# Altium schematic sheet Motorcycle_ECU.SchDoc: Motorcycle_ECU
size A2; DrawnBy: mzy2364; Revision: V3.5
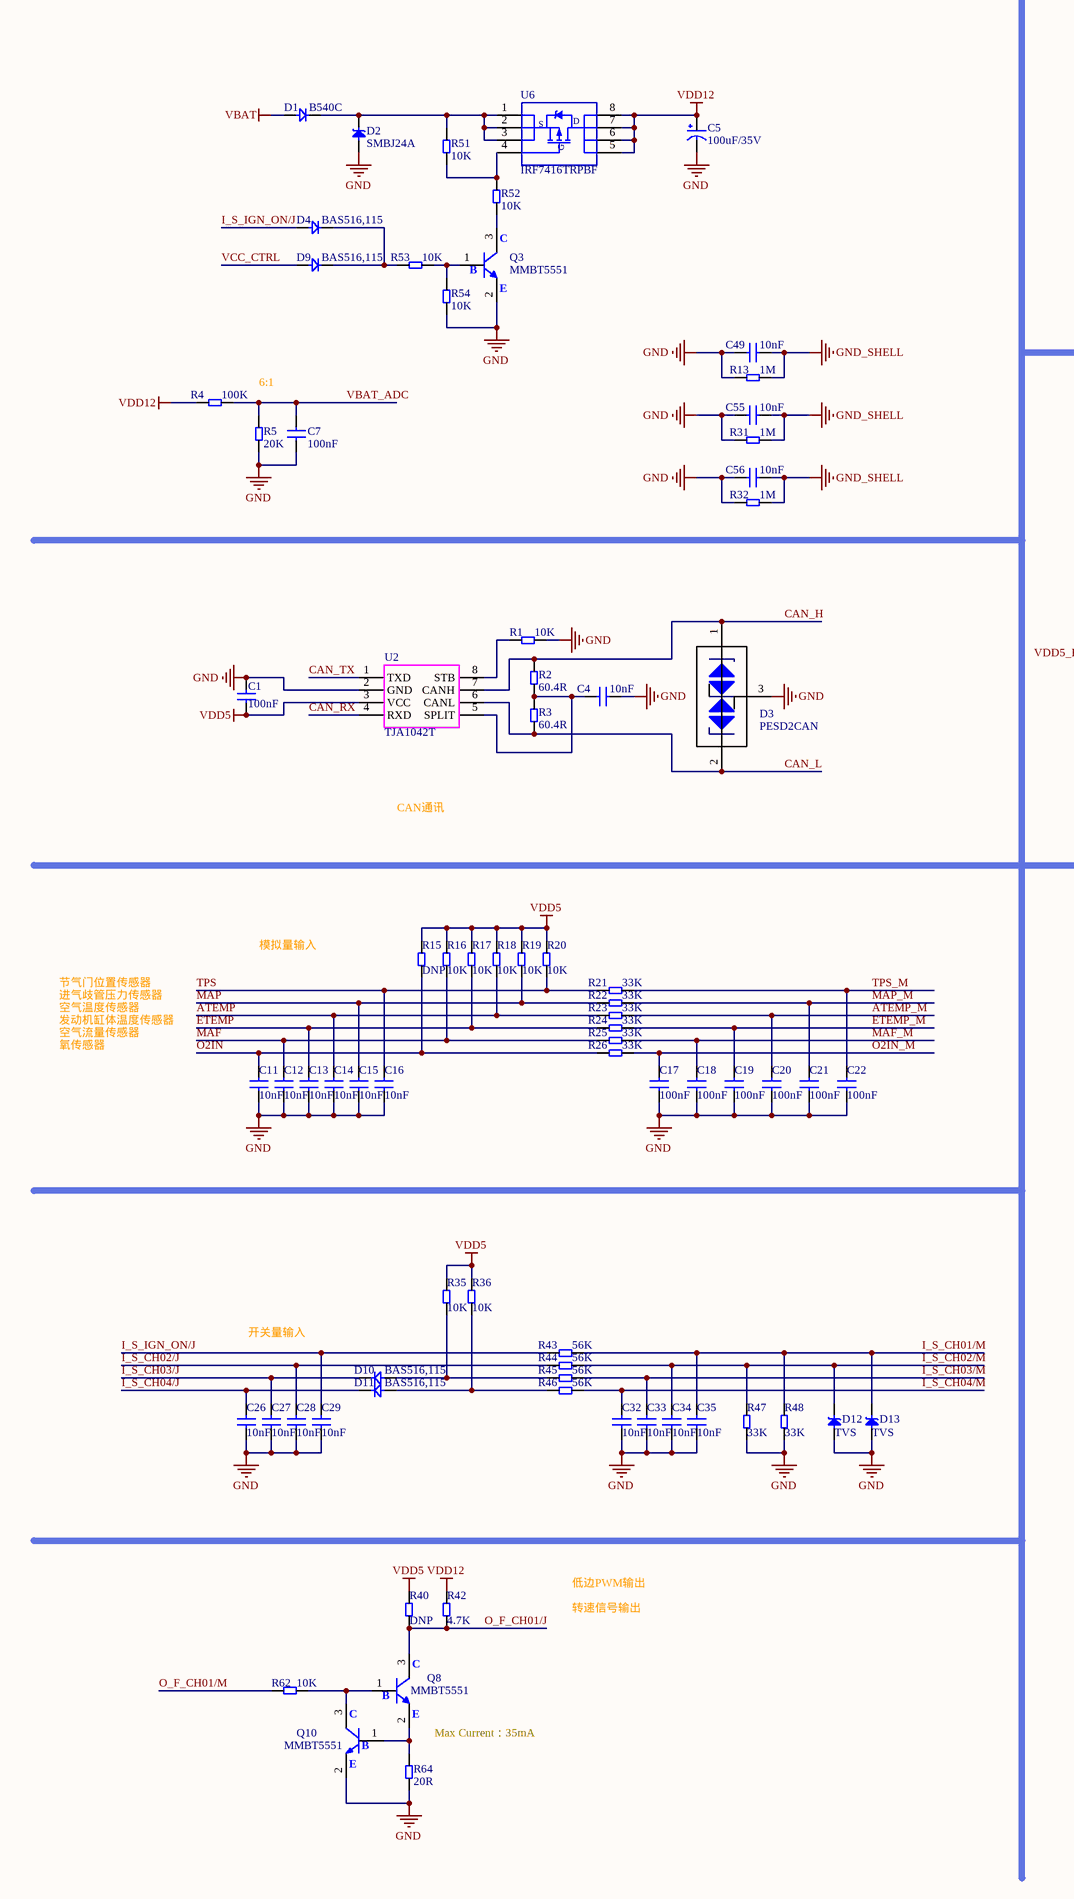
[diagram p0: Motorcycle_ECU.SchDoc, left]
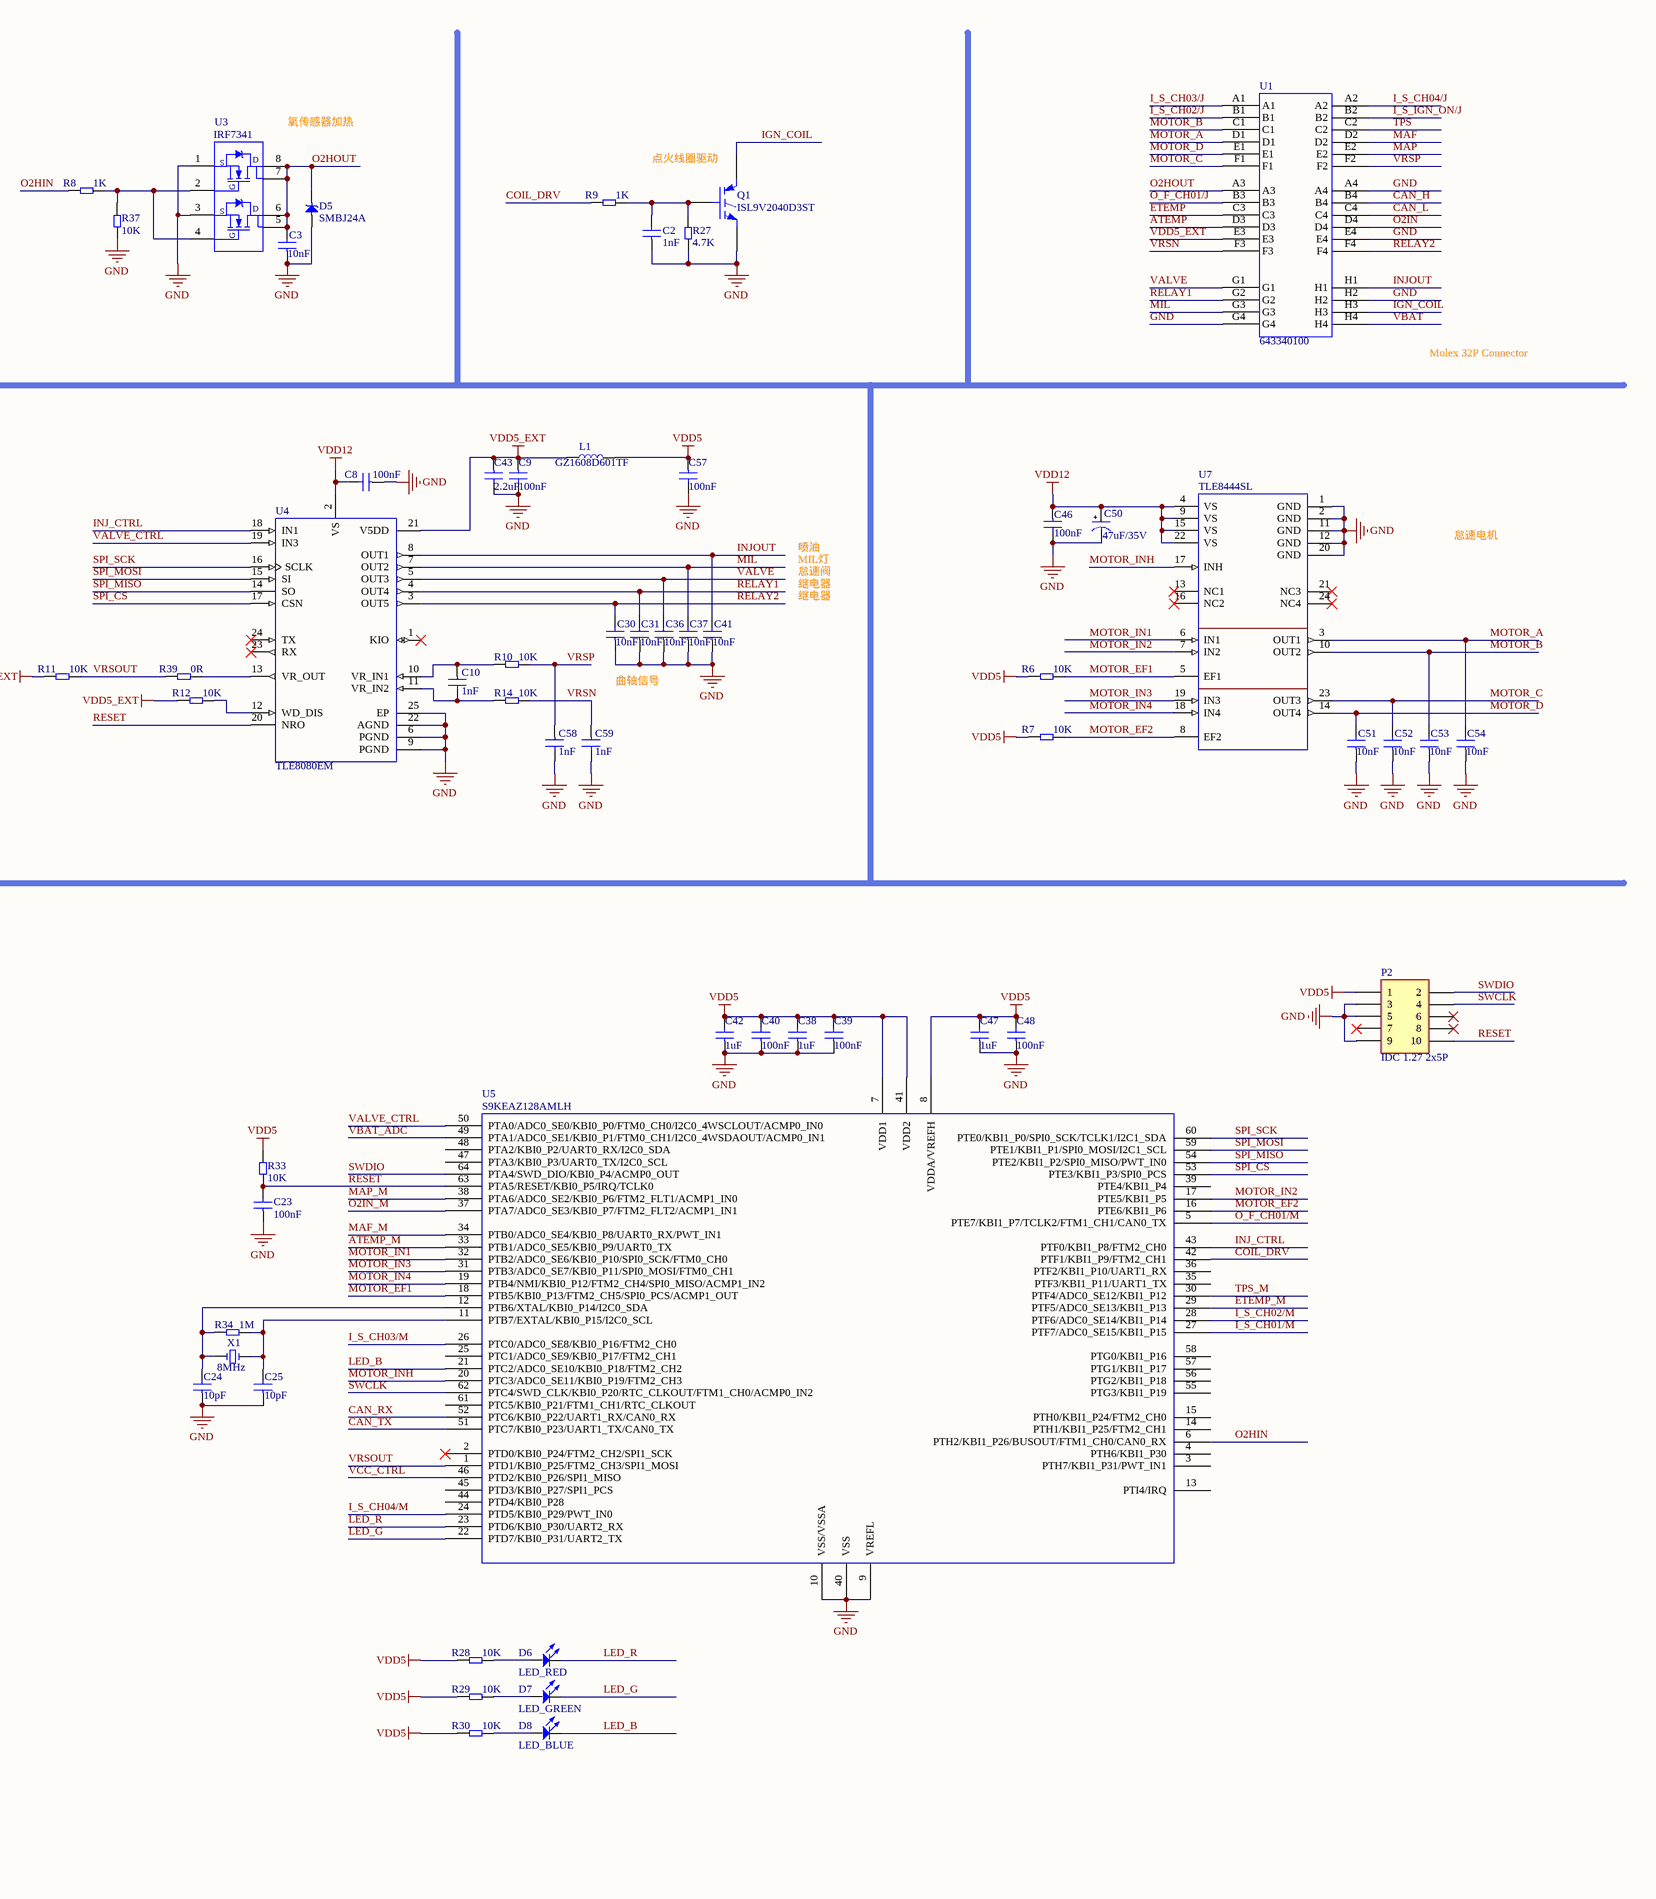
[diagram p1: Motorcycle_ECU.SchDoc, right]

## Parts
C1  100nF  [C0603]
C2  1nF  [C0603]
C3  10nF  [C0603]
C4  10nF  [C0603]
C5  100uF/35V  [CM E(8*10.2)]
C7  100nF  [C0603]
C8  100nF  [C0603]
C9  100nF  [C0603]
C10  1nF  [C0603]
C11  10nF  [C0603]
C12  10nF  [C0603]
C13  10nF  [C0603]
C14  10nF  [C0603]
C15  10nF  [C0603]
C16  10nF  [C0603]
C17  100nF  [C0603]
C18  100nF  [C0603]
C19  100nF  [C0603]
C20  100nF  [C0603]
C21  100nF  [C0603]
C22  100nF  [C0603]
C23  100nF  [C0603]
C24  10pF  [C0603]
C25  10pF  [C0603]
C26  10nF  [C0603]
C27  10nF  [C0603]
C28  10nF  [C0603]
C29  10nF  [C0603]
C30  10nF  [C0603]
C31  10nF  [C0603]
C32  10nF  [C0603]
C33  10nF  [C0603]
C34  10nF  [C0603]
C35  10nF  [C0603]
C36  10nF  [C0603]
C37  10nF  [C0603]
C38  1uF  [C0603]
C39  100nF  [C0603]
C40  100nF  [C0603]
C41  10nF  [C0603]
C42  1uF  [C0603]
C43  2.2uF  [C0603]
C46  100nF  [C0603]
C47  1uF  [C0603]
C48  100nF  [C0603]
C49  10nF  [C0603]
C50  47uF/35V  [CM D(6.3*7.7)]
C51  10nF  [C0603]
C52  10nF  [C0603]
C53  10nF  [C0603]
C54  10nF  [C0603]
C55  10nF  [C0603]
C56  10nF  [C0603]
C57  100nF  [C0603]
C58  1nF  [C0603]
C59  1nF  [C0603]
D1  B540C  [SMC]
D2  SMBJ24A  [SMB]
D3  PESD2CAN  [SOT23]
D4  BAS516,115  [SOD-523]
D5  SMBJ24A  [SMB]
D6  LED_RED  [LED 0603]
D7  LED_GREEN  [LED 0603]
D8  LED_BLUE  [LED 0603]
D9  BAS516,115  [SOD-523]
D10  BAS516,115  [SOD-523]
D11  BAS516,115  [SOD-523]
D12  TVS  [SOD-523]
D13  TVS  [SOD-523]
L1  GZ1608D601TF  [L_0603]
P2  IDC 1.27 2x5P  [IDC-TH_10P-P1.27-X1270WV-2X05A-6TV01]
Q1  ISL9V2040D3ST  [TO252]
Q3  MMBT5551  [SOT23]
Q8  MMBT5551  [SOT23]
Q10  MMBT5551  [SOT23]
R1  10K  [RES0603]
R2  60.4R  [RES0603]
R3  60.4R  [RES0603]
R4  100K  [RES0603]
R5  20K  [RES0603]
R6  10K  [RES0603]
R7  10K  [RES0603]
R8  1K  [RES0603]
R9  1K  [RES0603]
R10  10K  [RES0603]
R11  10K  [RES0603]
R12  10K  [RES0603]
R13  1M  [RES0603]
R14  10K  [RES0603]
R15  DNP  [RES0603]
R16  10K  [RES0603]
R17  10K  [RES0603]
R18  10K  [RES0603]
R19  10K  [RES0603]
R20  10K  [RES0603]
R21  33K  [RES0603]
R22  33K  [RES0603]
R23  33K  [RES0603]
R24  33K  [RES0603]
R25  33K  [RES0603]
R26  33K  [RES0603]
R27  4.7K  [RES0603]
R28  10K  [RES0603]
R29  10K  [RES0603]
R30  10K  [RES0603]
R31  1M  [RES0603]
R32  1M  [RES0603]
R33  10K  [RES0603]
R34  1M  [RES0603]
R35  10K  [RES0603]
R36  10K  [RES0603]
R37  10K  [RES0603]
R39  0R  [RES0603]
R40  DNP  [RES0603]
R42  4.7K  [RES0603]
R43  56K  [RES0603]
R44  56K  [RES0603]
R45  56K  [RES0603]
R46  56K  [RES0603]
R47  33K  [RES0603]
R48  33K  [RES0603]
R51  10K  [RES0603]
R52  10K  [RES0603]
R53  10K  [RES0603]
R54  10K  [RES0603]
R62  10K  [RES0603]
R64  20R  [RES0603]
U1  643340100  [MOLEX-32P_SHARP_1]
U2  TJA1042T  [SOIC8-150MIL]
U3  IRF7341  [SOIC8-150MIL]
U4  TLE8080EM  [INF-PG-SSOP-24-4]
U5  S9KEAZ128AMLH  [LQFP64-0.5]
U6  IRF7416TRPBF  [SOIC8-150MIL]
U7  TLE8444SL  [INF-PG-SSOP-24]
X1  8MHz  [OSC 5032-2P]

## Nets
GND: C1.2 C2.1 C3.1 C4.2 C5.2(GND) C7.1 C8.1 C9.2 C11.1 C12.1 C13.1 C14.1 C15.1 C16.1 C17.1 C18.1 C19.1 C20.1 C21.1 C22.1 C23.1 C24.1 C25.1 C26.1 C27.1 C28.1 C29.1 C30.1 C31.1 C32.1 C33.1 C34.1 C35.1 C36.1 C37.1 C38.1 C39.1 C40.1 C41.1 C42.1 C43.2 C46.2 C47.1 C48.1 C49.2 C50.2(GND) C51.1 C52.1 C53.1 C54.1 C55.2 C56.2 C57.2 C58.2 C59.2 D2.1 D3.3 D5.1 D12.1 D13.1 P2.3 P2.5 P2.9 Q1.3(E) Q3.2(E) Q10.2(E) R1.1(BST) R5.1(BST) R13.2(BST) R27.1(BST) R31.2(BST) R32.2(BST) R37.1(BST) R47.1(BST) R48.1(BST) R54.1(BST) R64.1(BST) U1.A4 U1.E4 U1.G4 U1.H2 U2.2(GND) U3.1(S2) U3.3(S1) U4.6(PGND) U4.9(PGND) U4.22(AGND) U4.25(EP) U5.9(VREFL) U5.10(VSS/VSSA) U5.40(VSS) U7.1(GND) U7.2(GND) U7.11(GND) U7.12(GND) U7.20(GND)
GND_SHELL: C49.1 C55.1 C56.1 R13.1(BST) R31.1(BST) R32.1(BST)
VBAT: D1.1 U1.H4
VDD5: C1.1 C38.2 C39.2 C40.2 C42.2 C47.2 C48.2 C57.1 L1.1 P2.1 R6.2(BST) R7.2(BST) R15.2(BST) R16.2(BST) R17.2(BST) R18.2(BST) R19.2(BST) R20.2(BST) R28.2(BST) R29.2(BST) R30.2(BST) R33.2(BST) R35.2(BST) R36.2(BST) R40.2(BST) U2.3(VCC) U5.7(VDD1) U5.8(VDDA/VREFH) U5.41(VDD2)
VDD5_EXT: C9.1 C43.1 L1.2 R11.2(BST) R12.2(BST) U1.E3 U4.21(V5DD)
VDD12: C5.1(VCC) C8.2 C46.1 C50.1(VCC) R4.1(BST) R42.2(BST) U4.2(VS) U6.5(D) U6.6 U6.7(D) U6.8(D) U7.4(VS) U7.9(VS) U7.15(VS) U7.22(VS)
ATEMP: C14.2 R18.1(BST) R23.1(BST) U1.D3
ATEMP_M: C20.2 R23.2(BST) U5.33(PTB1/ADC0_SE5/KBI0_P9/UART0_TX)
CAN_H: D3.1 R2.2(BST) U1.B4 U2.7(CANH)
CAN_L: D3.2 R3.1(BST) U1.C4 U2.6(CANL)
CAN_RX: U2.4(RXD) U5.52(PTC6/KBI0_P22/UART1_RX/CAN0_RX)
CAN_TX: U2.1(TXD) U5.51(PTC7/KBI0_P23/UART1_TX/CAN0_TX)
COIL_DRV: R9.1(BST) U5.42(PTF1/KBI1_P9/FTM2_CH1)
ETEMP: C13.2 R17.1(BST) R24.1(BST) U1.C3
ETEMP_M: C19.2 R24.2(BST) U5.29(PTF5/ADC0_SE13/KBI1_P13)
I_S_CH01/M: C35.2 D13.2 R43.2(BST) R48.2(BST) U5.27(PTF7/ADC0_SE15/KBI1_P15)
I_S_CH02/J: C28.2 R44.1(BST) U1.B1
I_S_CH02/M: C34.2 D12.2 R44.2(BST) R47.2(BST) U5.28(PTF6/ADC0_SE14/KBI1_P14)
I_S_CH03/J: C27.2 D10.2 U1.A1
I_S_CH03/M: C33.2 R45.2(BST) U5.26(PTC0/ADC0_SE8/KBI0_P16/FTM2_CH0)
I_S_CH04/J: C26.2 D11.2 U1.A2
I_S_CH04/M: C32.2 R46.2(BST) U5.24(PTD5/KBI0_P29/PWT_IN0)
I_S_IGN_ON/J: C29.2 D4.1 R43.1(BST) U1.B2
IGN_COIL: Q1.2(C) U1.H3
INJ_CTRL: U4.18(IN1) U5.43(PTF0/KBI1_P8/FTM2_CH0)
INJOUT: C41.2 U1.H1 U4.8(OUT1)
LED_B: D8.2(K) U5.21(PTC2/ADC0_SE10/KBI0_P18/FTM2_CH2)
LED_G: D7.2(K) U5.22(PTD7/KBI0_P31/UART2_TX)
LED_R: D6.2(K) U5.23(PTD6/KBI0_P30/UART2_RX)
MAF: C12.2 R16.1(BST) R25.1(BST) U1.D2
MAF_M: C18.2 R25.2(BST) U5.34(PTB0/ADC0_SE4/KBI0_P8/UART0_RX/PWT_IN1)
MAP: C15.2 R19.1(BST) R22.1(BST) U1.E2
MAP_M: C21.2 R22.2(BST) U5.38(PTA6/ADC0_SE2/KBI0_P6/FTM2_FLT1/ACMP1_IN0)
MIL: C37.2 U1.G3 U4.7(OUT2)
MOTOR_A: C54.2 U1.D1 U7.3(OUT1)
MOTOR_B: C53.2 U1.C1 U7.10(OUT2)
MOTOR_C: C52.2 U1.F1 U7.23(OUT3)
MOTOR_D: C51.2 U1.E1 U7.14(OUT4)
MOTOR_EF1: R6.1(BST) U5.18(PTB5/KBI0_P13/FTM2_CH5/SPI0_PCS/ACMP1_OUT) U7.5(EF1)
MOTOR_EF2: R7.1(BST) U5.16(PTE6/KBI1_P6) U7.8(EF2)
MOTOR_IN1: U5.32(PTB2/ADC0_SE6/KBI0_P10/SPI0_SCK/FTM0_CH0) U7.6(IN1)
MOTOR_IN2: U5.17(PTE5/KBI1_P5) U7.7(IN2)
MOTOR_IN3: U5.31(PTB3/ADC0_SE7/KBI0_P11/SPI0_MOSI/FTM0_CH1) U7.19(IN3)
MOTOR_IN4: U5.19(PTB4/NMI/KBI0_P12/FTM2_CH4/SPI0_MISO/ACMP1_IN2) U7.18(IN4)
MOTOR_INH: U5.20(PTC3/ADC0_SE11/KBI0_P19/FTM2_CH3) U7.17(INH)
O2HIN: R8.1(BST) U5.6(PTH2/KBI1_P26/BUSOUT/FTM1_CH0/CAN0_RX)
O2HOUT: C3.2 D5.2 U1.A3 U3.5(D1) U3.6(D1) U3.7(D2) U3.8(D2)
O2IN: C11.2 R15.1(BST) R26.1(BST) U1.D4
O2IN_M: C17.2 R26.2(BST) U5.37(PTA7/ADC0_SE3/KBI0_P7/FTM2_FLT2/ACMP1_IN1)
O_F_CH01/J: Q8.3(C) R40.1(BST) R42.1(BST) U1.B3
O_F_CH01/M: R62.2(BST) U5.5(PTE7/KBI1_P7/TCLK2/FTM1_CH1/CAN0_TX)
RELAY1: C31.2 U1.G2 U4.4(OUT4)
RELAY2: C30.2 U1.F4 U4.3(OUT5)
RESET: C23.2 P2.10 R33.1(BST) U4.20(NRO) U5.63(PTA5/RESET/KBI0_P5/IRQ/TCLK0)
SPI_CS: U4.17(CSN) U5.53(PTE3/KBI1_P3/SPI0_PCS)
SPI_MISO: U4.14(SO) U5.54(PTE2/KBI1_P2/SPI0_MISO/PWT_IN0)
SPI_MOSI: U4.15(SI) U5.59(PTE1/KBI1_P1/SPI0_MOSI/I2C1_SCL)
SPI_SCK: U4.16(SCLK) U5.60(PTE0/KBI1_P0/SPI0_SCK/TCLK1/I2C1_SDA)
SWCLK: P2.4 U5.62(PTC4/SWD_CLK/KBI0_P20/RTC_CLKOUT/FTM1_CH0/ACMP0_IN2)
SWDIO: P2.2 U5.64(PTA4/SWD_DIO/KBI0_P4/ACMP0_OUT)
TPS: C16.2 R20.1(BST) R21.1(BST) U1.C2
TPS_M: C22.2 R21.2(BST) U5.30(PTF4/ADC0_SE12/KBI1_P12)
VALVE: C36.2 U1.G1 U4.5(OUT3)
VALVE_CTRL: U4.19(IN3) U5.50(PTA0/ADC0_SE0/KBI0_P0/FTM0_CH0/I2C0_4WSCLOUT/ACMP0_IN0)
VBAT_ADC: C7.2 R4.2(BST) R5.2(BST) U5.49(PTA1/ADC0_SE1/KBI0_P1/FTM0_CH1/I2C0_4WSDAOUT/ACMP0_IN1)
VCC_CTRL: D9.1 U5.46(PTD2/KBI0_P26/SPI1_MISO)
VRSN: C59.1 R14.1(BST) U1.F3
VRSOUT: R11.1(BST) R39.2(BST) U5.1(PTD1/KBI0_P25/FTM2_CH3/SPI1_MOSI)
VRSP: C58.1 R10.1(BST) U1.F2
NetC2_2: C2.2 Q1.1(G) R9.2(BST) R27.2(BST)
NetC4_1: C4.1 R2.1(BST) R3.2(BST) U2.5(SPLIT)
NetC10_1: C10.1 R10.2(BST) U4.10(VR_IN1)
NetC10_2: C10.2 R14.2(BST) U4.11(VR_IN2)
NetC24_2: C24.2 R34.1(BST) U5.12(PTB6/XTAL/KBI0_P14/I2C0_SDA) X1.1
NetC25_2: C25.2 R34.2(BST) U5.11(PTB7/EXTAL/KBI0_P15/I2C0_SCL) X1.2
NetD1_2: D1.2 D2.2 R51.2(BST) U6.1(S) U6.2(S) U6.3(S)
NetD4_2: D4.2 D9.2 R53.1(BST)
NetD6_1: D6.1(A) R28.1(BST)
NetD7_1: D7.1(A) R29.1(BST)
NetD8_1: D8.1(A) R30.1(BST)
NetD10_1: D10.1 R35.1(BST) R45.1(BST)
NetD11_1: D11.1 R36.1(BST) R46.1(BST)
NetQ3_1: Q3.1(B) R53.2(BST) R54.2(BST)
NetQ3_3: Q3.3(C) R52.1(BST)
NetQ8_1: Q8.1(B) Q10.3(C) R62.1(BST)
NetQ8_2: Q8.2(E) Q10.1(B) R64.2(BST)
NetR1_2: R1.2(BST) U2.8(STB)
NetR8_2: R8.2(BST) R37.2(BST) U3.2(G2) U3.4(G1)
NetR12_1: R12.1(BST) U4.12(WD_DIS)
NetR39_1: R39.1(BST) U4.13(VR_OUT)
NetR51_1: R51.1(BST) R52.2(BST) U6.4(G)

Not connected (* = marked no-connect by the designer): P2 6* 7* 8*; U4 1(KIO)* 23(RX)* 24(TX)*; U5 2(PTD0/KBI0_P24/FTM2_CH2/SPI1_SCK)* 3(PTH7/KBI1_P31/PWT_IN1) 4(PTH6/KBI1_P30) 13(PTI4/IRQ) 14(PTH1/KBI1_P25/FTM2_CH1) 15(PTH0/KBI1_P24/FTM2_CH0) 25(PTC1/ADC0_SE9/KBI0_P17/FTM2_CH1) 35(PTF3/KBI1_P11/UART1_TX) 36(PTF2/KBI1_P10/UART1_RX) 39(PTE4/KBI1_P4) 44(PTD4/KBI0_P28) 45(PTD3/KBI0_P27/SPI1_PCS) 47(PTA3/KBI0_P3/UART0_TX/I2C0_SCL) 48(PTA2/KBI0_P2/UART0_RX/I2C0_SDA) 55(PTG3/KBI1_P19) 56(PTG2/KBI1_P18) 57(PTG1/KBI1_P17) 58(PTG0/KBI1_P16) 61(PTC5/KBI0_P21/FTM1_CH1/RTC_CLKOUT); U7 13(NC1)* 16(NC2)* 21(NC3)* 24(NC4)*

## Notes on the sheet
- (near U3) 氧传感器加热
- (near Q1) 点火线圈驱动
- Molex 32P Connector
- 6:1
- 喷油
- MIL灯
- 怠速阀
- 继电器
- 怠速电机
- 曲轴信号
- CAN通讯
- 节气门位置传感器
- 进气歧管压力传感器
- 模拟量输入
- 空气温度传感器
- 发动机缸体温度传感器
- 空气流量传感器
- 氧传感器
- 开关量输入
- 低边PWM输出
- 转速信号输出
- Max Current：35mA
- (in symbol AO4800) S; D; G

## Library data of the parts
C1 C4 C24 C25 = CAP
C2 C3 C7-C23 C26-C43 C46-C49 C51-C59 = CAP: Voltage: 50V; Precision: 10%; Material: X7R
C5 C50 = C POL
D1 D4 D9-D11 = D
D2 D5 D12 D13 = D TVS
D6-D8 = LED
L1 = L
P2 = SWD10-1.27: LatestRevisionDate: 17-Jul-2002; LatestRevisionNote: Re-released for DXP Platform.; Publisher: Altium Limited; Part Name: SWD10-1.27
Q1 = AOD5B65M1
Q3 Q8 = NPN
Q10 = NPN_1
R1-R37 R39 R40 R42-R48 R51-R54 R62 R64 = RES
U1 = 643340100: MOLEX 32P接插件
U2 = TJA1042T: CAN收发器
U3 = AO4800: NMOS 双通道
U4 = TLE8080EM: Engine Management IC for Small Engine, 6 to 18 V Supply, PG-SSOP-24-4, Reel, Green; Manufacturer: Infineon; 5-V Supply: 250 mA; Green: TRUE; Output Current Inductive Load Channel: 2 x 1,3 (2,6) A Nominal (max); Output Current Relay Channels: 2 x 300 (350) mA; Output Current Resistive Load Channel: 1 x 0,3 (3) A Nominal (max); Supply Voltage: 6 to 18 V; DatasheetVersion: Rev. 1.1; PackageVersion: Oct-12; PackageReference: PG-SSOP-24-4; PackageDescription: 24-Pin Plastic (Green) Shrink Small Outline Package, 8.65 x 3.9 mm Body, 0.65 mm Pitch; Supplier 1: Mouser; Supplier Part Number 1: N/A; Halogen-free: TRUE; K-Line acc. ISO 9141: TRUE; Packing: Reel; SPI I/F Diagnosis / Control: TRUE; VRS I/F: TRUE; Mounting Technology: Surface Mount; PartNumber: TLE8080EM; ComponentLink1Description: Manufacturer URL; ComponentLink1URL: http://www.infineon.com/; ComponentLink2Description: Datasheet; ComponentLink2URL: http://www.infineon.com/dgdl/TLE8080EM_DS_11.pdf?folderId=db3a30431b3e89eb011bb632994f065b&fileId=db3a30433a047ba0013a446d32b90bb5&location=en.Products.Automotive_ICs.Powertrain_ICs.Power_Interface_Products_for_Motorcycle_and_Small_Engines.DATASHEET.TLE8080EM_DS_11.pdf; ComponentLink3Description: Package Specification; ComponentLink3URL: http://www.infineon.com/dgdl/TLE8088EM_DS_10.pdf?folderId=db3a30431b3e89eb011bb632994f065b&fileId=db3a30433a047ba0013a446e76be0bbb&location=en.Products.Automotive_ICs.Powertrain_ICs.Power_Interface_Products_for_Motorcycle_and_Small_Engines.DATASHEET.TLE8088EM_DS_10.pdf
U5 = S9KEAZ64AMLH: Part Name: S9KEAZ64AMLH
U6 = FDS4435BZ
U7 = TLE8444SL: Quad Half-Bridge Driver IC; Manufacturer: Infineon Technologies; ManufacturerPartNumber: TLE8444SL; PackageReference: PG-SSOP-24-7
X1 = XTAL-2P